# Altium schematic sheet POWER.SchDoc: Science - 4_Power
size Letter; DrawnBy: Christopher Arjune; Organization: UW Robotics; Address1: 200 University Avenue; Address2: Waterloo; Address3: Ontario; Address4: Canada N2L 3G6; SheetNumber: 4; SheetTotal: 6
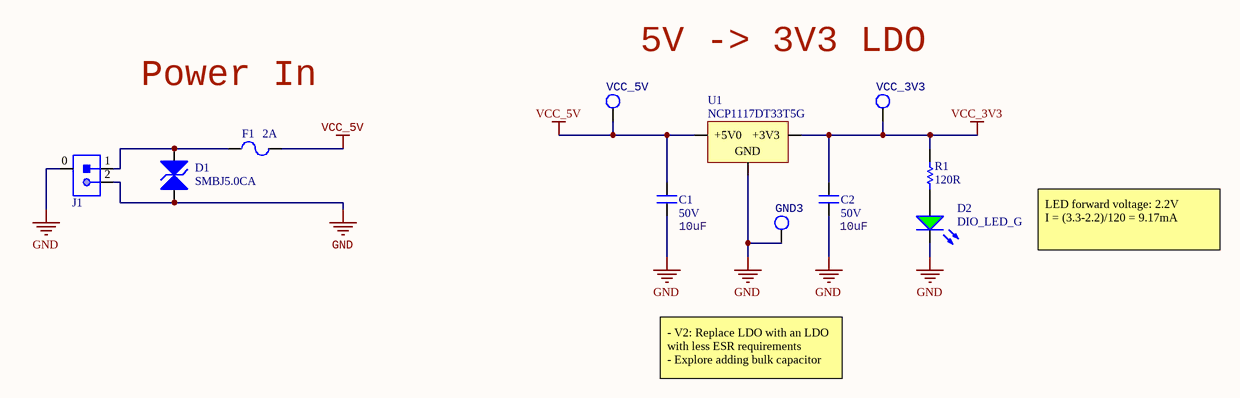
[diagram p0: POWER.SchDoc]

## Parts
C1  Voltage Rating: 50V  [CAPC1206(3216)]  (hidden comment: 10uF)
C2  Voltage Rating: 50V  [CAPC1206(3216)]  (hidden comment: 10uF)
D1  Manufacturer Part Number 1: SMBJ5.0CA  [TVS_DIODE_BIDIRECTIONAL]  (hidden comment: TVS_DIODE_BIDIRECTIONAL)
D2  DIO_LED_G  [LED_0805_LINE]
F1  Current Rating: 2A  [FUSE_0603]  (hidden comment: FUSE_2A_0603)
GND3  TESTPOINT_LOOP  [TESTPOINT_LOOP]  (value not drawn)
J1  CON_2M_SM_RA  [MOLEX-5024940270]  (value not drawn)
R1  value 120R  [RESC0603(1608)_N]  (hidden comment: RES_120R_0603)
U1  MPN: NCP1117DT33T5G  [VOLTAGE_REGULATOR]  (hidden comment: 5V0_3V3_LDO)
VCC_3V3  TESTPOINT_LOOP  [TESTPOINT_LOOP]  (value not drawn)
VCC_5V  TESTPOINT_LOOP  [TESTPOINT_LOOP]  (value not drawn)

## Nets
GND: C1.2 C2.2 D1.2 D2.2(K) GND3.1 J1.0 J1.2 U1.1(GND)
VCC_3V3: C2.1 R1.2 U1.2(+3V3) VCC_3V3.1
VCC_5V: C1.1 F1.2 U1.3(+5V0) VCC_5V.1
NetD1_1: D1.1 F1.1 J1.1
NetD2_1: D2.1(A) R1.1

## Notes on the sheet
- Power In
- 5V -> 3V3 LDO
- LED forward voltage: 2.2V
  I = (3.3-2.2)/120 = 9.17mA
- - V2: Replace LDO with an LDO with less ESR requirements
  - Explore adding bulk capacitor
- Title
- Size:
- Date:
- Letter
- Drawn By:
- Sheet
- of
- File:

## Library data of the parts
C1 C2 = CAP_10uF_50V_1206: CAP CER 10UF 50V X5R 1206; MPN: GRT31CR61H106KE01L; Manufacturer: Murata; Dimensions: 0.126" L x 0.063" W (3.20mm x 1.6mm); Package: 1206 (3216 Metric); Value: 10uF; Supplier Part Number 1: 490-12456-1-ND; Supplier 1: Digi-Key
D1 = TVS_DIODE_BIDIRECTIONAL: TVS DIODE 5V 9.2V DO214AA; Manufacturer 1: Littelfuse; Max Surge Current: 65.3A; Reverse Breakdown Voltage: 6.4V; Peak Pulse Power: 600W; Max Breakdown Voltage: 7V; ESD Protection: Yes; Package: DO-214AA, SMB; ComponentLink1Description: Datasheet; ComponentLink1URL: https://www.littelfuse.com/~/media/electronics/datasheets/tvs_diodes/littelfuse_tvs_diode_smbj_datasheet.pdf.pdf; Supplier Part Number 1: SMBJ5.0CALFCT-ND; Supplier 1: Digi-Key; Mount: Surface Mount; Min Operating Temperature: -65°C; Max Operating Temperature: 150°C; Direction: Bidirectional; Reverse Standoff Voltage: 5V; Min Breakdown Voltage: 6.4V; Clamping Voltage: 9.2V; Breakdown Voltage: 6.4V; Polarity: Bidirectional; Power Dissipation: 600W; Peak Pulse Current: 65.3A; Composition: Zener
D2 = DIO_LED_G: LED GREEN DIFFUSED 0805 SMD; MPN: LG R971-KN-1; Manufacturer: OSRAM; Forward Voltage Drop: 2.2V; Package: 0805 (2012 Metric); Supplier Part Number 1: 475-1410-1-ND; Supplier 1: Digi-Key
F1 = FUSE_2A_0603: FUSE SMD 2A 32V; ComponentLink1URL: https://datasheet.ciiva.com/303/467-303400.pdf?src-supplier=Digi-Key; ComponentLink1Description: https://datasheet.ciiva.com/303/467-303400.pdf?src-supplier=Digi-Key; ComponentLink2URL: http://datasheet.octopart.com/0467002.NRHF-Littelfuse-datasheet-32023482.pdf?src-supplier=Future+Electronics; ComponentLink2Description: http://datasheet.octopart.com/0467002.NRHF-Littelfuse-datasheet-32023482.pdf?src-supplier=Future+Electronics; ComponentLink3URL: http://datasheet.octopart.com/0467002.NRHF-Littelfuse-datasheet-136509808.pdf?src-supplier=Future+Electronics; ComponentLink3Description: http://datasheet.octopart.com/0467002.NRHF-Littelfuse-datasheet-136509808.pdf?src-supplier=Future+Electronics; Mount: Surface Mount; Voltage Rating (AC): 32V; Voltage Rating (DC): 32V; Supplier 1: Digi-Key; Supplier Part Number 1: F7132CT-ND; Supplier Packaging 1: Cut Tape
GND3 VCC_3V3 VCC_5V = TESTPOINT_LOOP: Loop testpoint through-hole pad; Manufacturer: Keystone Electronics; Manufacturer Part Number 1: 5002; Supplier Part Number 1: 36-5002-ND; Supplier 1: Digi-Key
J1 = CON_2M_SM_RA: CONN HEADER SMD RIGHT ANGLE 2MM PITCH; Manufacturer 1: Molex; Manufacturer Part Number 1: 5024940270; Connector Type: Receptacle,Forked; Number of Positions: 2; Supplier 1: Digi-Key; Supplier Part Number 1: WM15810CT-ND; ComponentLink1URL: https://www.molex.com/pdm_docs/as/AS-502439-002-001.pdf?src-supplier=Digi-Key; ComponentLink1Description: https://www.molex.com/pdm_docs/as/AS-502439-002-001.pdf?src-supplier=Digi-Key; Stock 1: 3397; Pricing 1: 1=0.53000, 10=0.49400, 25=0.44440, 50=0.39500, 100=0.37850, 250=0.34556 (USD); RoHS: No; Mount: Surface Mount; Contact Plating: Tin; Insulation Color: Natural; Insulation Material: Resin; Min Operating Temperature: -40°C; Max Operating Temperature: 105°C; Fastening Type: Latch; Packaging: Tape and Reel; Number of Rows: 1; Termination: Solder; Flammability Rating: UL94 V-0
R1 = RES_120R_0603: RES SMD 120 OHM 5% 1/10W 0603; Manufacturer: Yageo; MPN: RC0603JR-07120RL; Dimensions: 0.063" L x 0.031" W (1.60mm x 0.80mm); Tolerance: 5%; Package: 0603 (1608 Metric); Supplier Part Number 1: 311-120GRCT-ND; Supplier 1: Digi-Key
U1 = 5V0_3V3_LDO: IC REG LINEAR 3.3V 1A DPAK; Manufacturer: ON Semiconductor; Current Output: 1A; Supplier Part Number 1: NCP1117DT33T5GOSCT-ND; Supplier 1: Digi-Key